# EAGLE design prog (EAGLE 9.2.2)
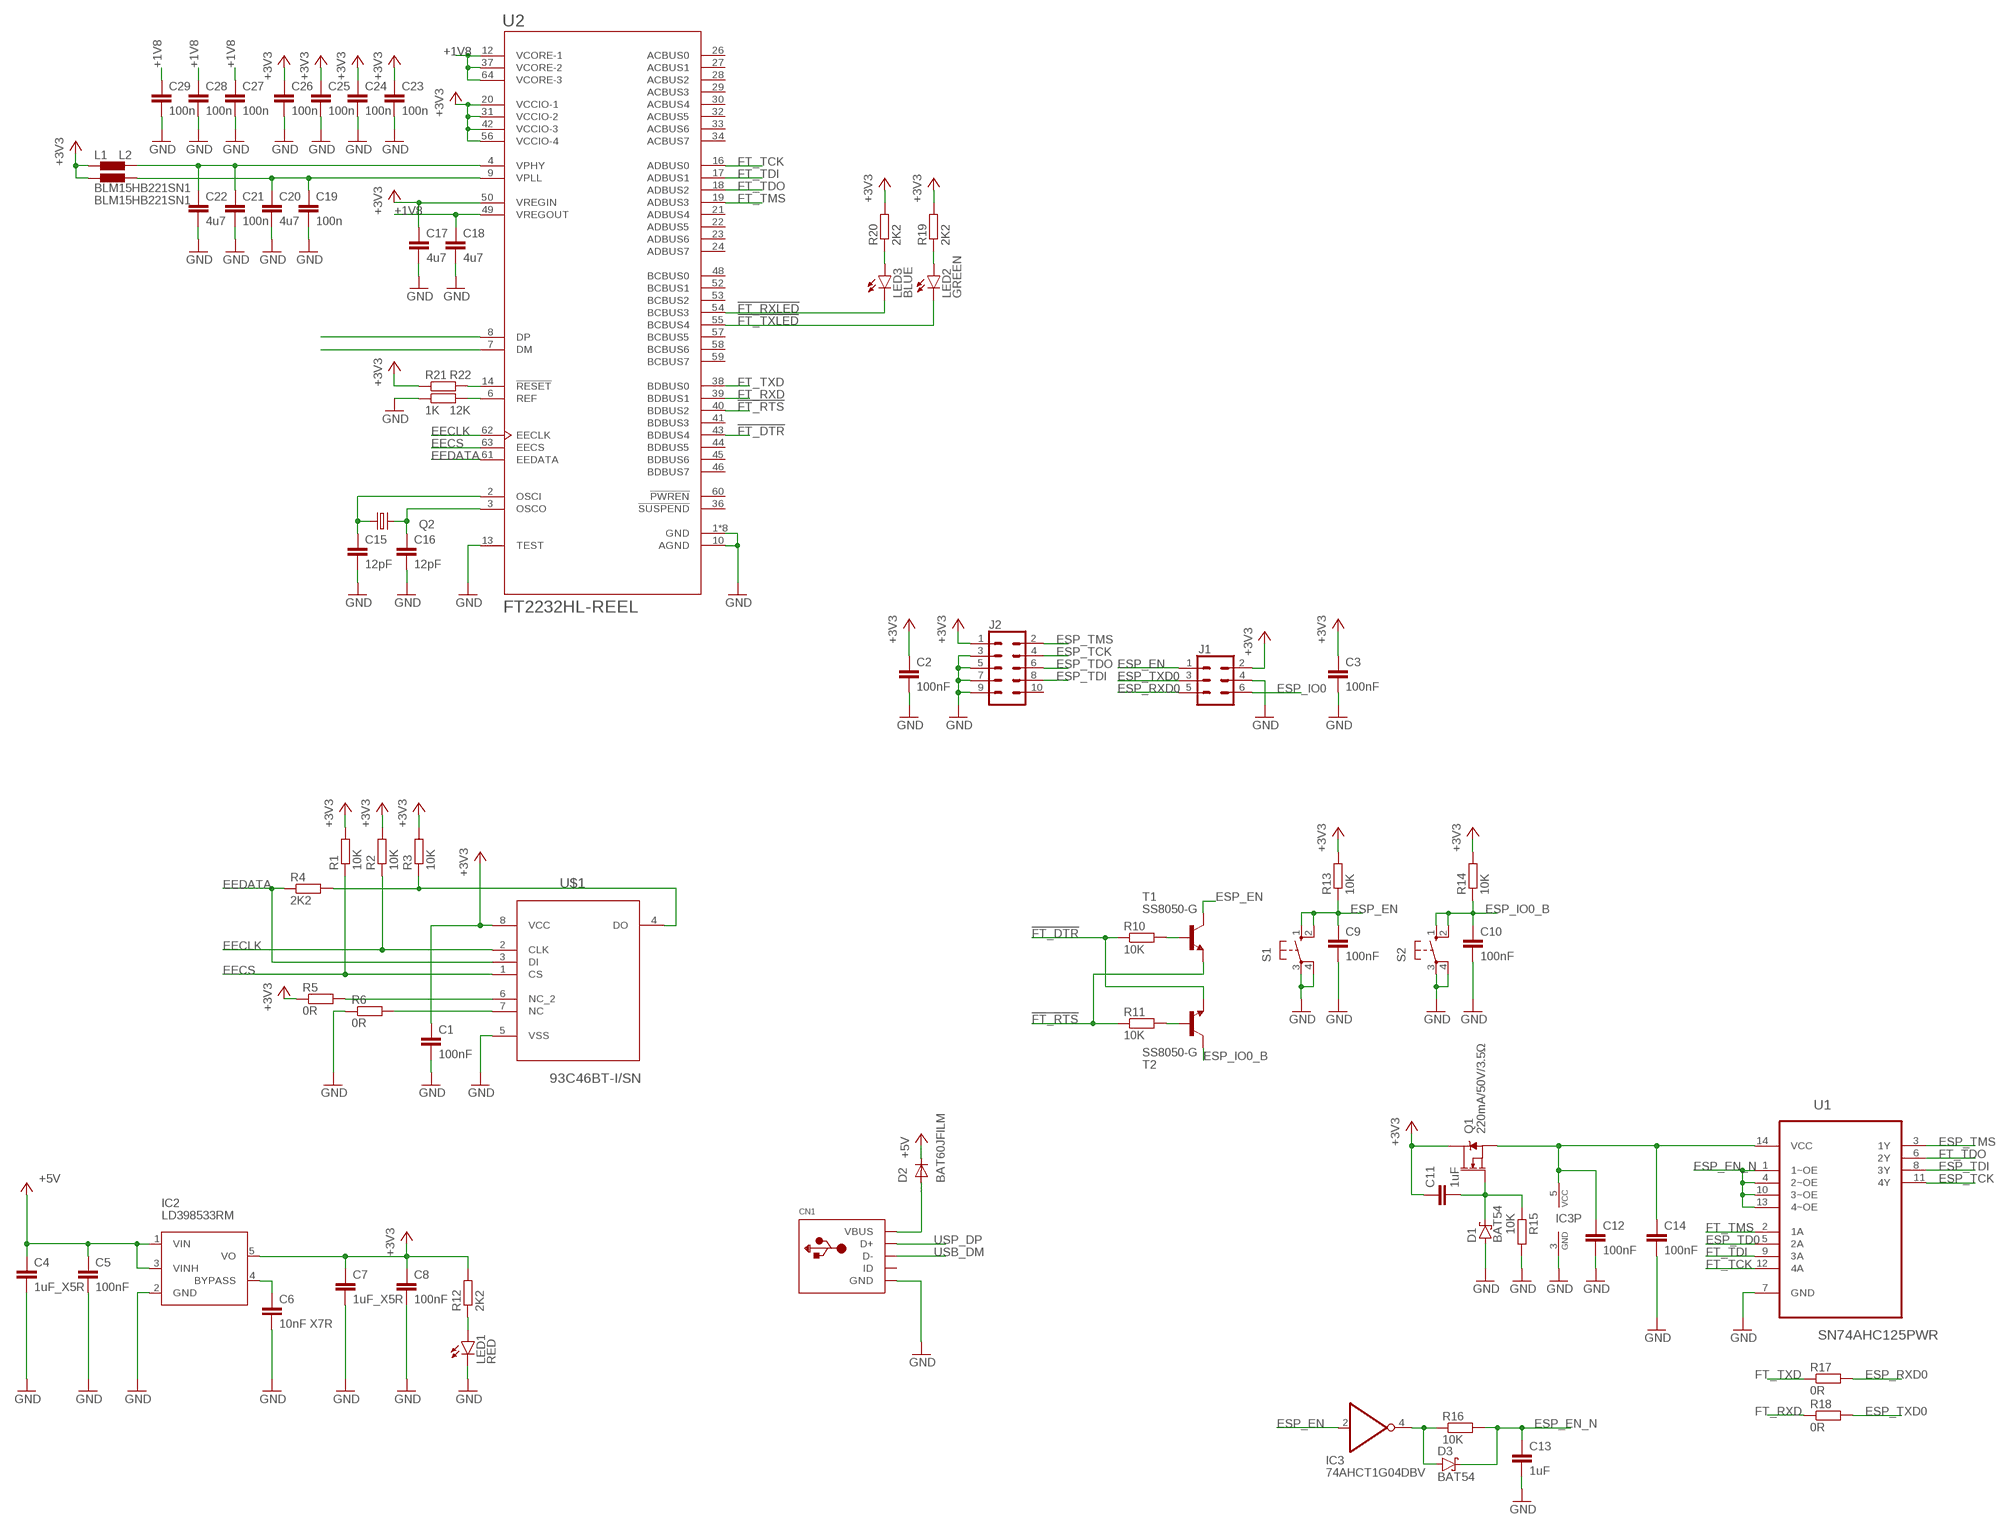
[diagram p0: schematic, sheet 1]

## Parts
C1  100nF  C-EUC0805  [C0805]
C2  100nF  C-EUC0805  [C0805]
C3  100nF  C-EUC0805  [C0805]
C4  1uF_X5R  C-EUC0805  [C0805]
C5  100nF  C-EUC0805  [C0805]
C6  10nF X7R  C-EUC0805  [C0805]
C7  1uF_X5R  C-EUC0805  [C0805]
C8  100nF  C-EUC0805  [C0805]
C9  100nF  C-EUC0805  [C0805]
C10  100nF  C-EUC0805  [C0805]
C11  1uF  C-EUC0805  [C0805]
C12  100nF  C-EUC0805  [C0805]
C13  1uF  C-EUC0805  [C0805]
C14  100nF  C-EUC0805  [C0805]
C15  12pF  C-EUC0805  [C0805]
C16  12pF  C-EUC0805  [C0805]
C17  4u7  C-EUC0805  [C0805]
C18  4u7  C-EUC0805  [C0805]
C19  100n  C-EUC0805  [C0805]
C20  4u7  C-EUC0805  [C0805]
C21  100n  C-EUC0805  [C0805]
C22  4u7  C-EUC0805  [C0805]
C23  100n  C-EUC0805  [C0805]
C24  100n  C-EUC0805  [C0805]
C25  100n  C-EUC0805  [C0805]
C26  100n  C-EUC0805  [C0805]
C27  100n  C-EUC0805  [C0805]
C28  100n  C-EUC0805  [C0805]
C29  100n  C-EUC0805  [C0805]
CN1  USBMINIB  [USB-MINIB]
D1  BAT54  [SOT23]
D2  BAT60JFILM  DIODE-SOD323-W  [SOD323-W]
D3  BAT54  [SOT23]
IC2  LD398533RM  [SOT23-5L]
IC3  74AHCT1G04DBV  [SOT23-5]
J1  CONN_03X2SHROUD  [2X3-SHROUDED]
J2  CONN_05X2SHD  [2X5-SHROUDED]
L1  BLM15HB221SN1  [0402]
L2  BLM15HB221SN1  [0402]
LED1  RED  LEDCHIP-LED0805  [CHIP-LED0805]
LED2  GREEN  LEDCHIPLED_0805  [CHIPLED_0805]
LED3  BLUE  LEDCHIPLED_0805  [CHIPLED_0805]
Q1  220mA/50V/3.5Ω  MOSFET-NCH-BSS138  [SOT23-3]
Q2  CRYSTALHC49UP  [HC49UP]
R1  10K  R-EU_R0805  [R0805]
R2  10K  R-EU_R0805  [R0805]
R3  10K  R-EU_R0805  [R0805]
R4  2K2  R-EU_R0805  [R0805]
R5  0R  R-EU_R0805  [R0805]
R6  0R  R-EU_R0805  [R0805]
R10  10K  R-EU_R0805  [R0805]
R11  10K  R-EU_R0805  [R0805]
R12  2K2  R-EU_R0805  [R0805]
R13  10K  R-EU_R0805  [R0805]
R14  10K  R-EU_R0805  [R0805]
R15  10K  R-EU_R0805  [R0805]
R16  10K  R-EU_R0805  [R0805]
R17  0R  R-EU_R0805  [R0805]
R18  0R  R-EU_R0805  [R0805]
R19  2K2  R-EU_R0805  [R0805]
R20  2K2  R-EU_R0805  [R0805]
R21  12K  R-EU_R0805  [R0805]
R22  1K  R-EU_R0805  [R0805]
S1  10-XX  [B3F-10XX]
S2  10-XX  [B3F-10XX]
T1  SS8050-G  BCF29-NPN-SOT23-BEC  [SOT23-BEC]
T2  SS8050-G  BCF29-NPN-SOT23-BEC  [SOT23-BEC]
U1  SN74AHC125PWR  [SOP65P640X120-14N]
U2  FT2232HL-REEL  [QFP50P1200X1200X160-64N]
U$1  93C46BT-I/SN  [SOIC127P600X175-8N]

## Nets
!FT_DTR: R10.1 T2.E U2.43(BDBUS4)
!FT_RTS: R11.1 T1.E U2.40(BDBUS2)
!FT_RXLED: LED3.C U2.54(BCBUS3)
!FT_TXLED: LED2.C U2.55(BCBUS4)
+1V8: C18.1 C27.1 C28.1 C29.1 U2.12(VCORE-1) U2.37(VCORE-2) U2.49(VREGOUT) U2.64(VCORE-3)
+3V3: C1.1 C2.1 C3.1 C7.1 C8.1 C11.1 C17.1 C23.1 C24.1 C25.1 C26.1 IC2.5(VO) J1.2 J2.1 L1.1 L2.1 Q1.3(D) R1.2 R2.2 R3.2 R5.1 R12.2 R13.2 R14.2 R19.2 R20.2 R22.1 U2.20(VCCIO-1) U2.31(VCCIO-2) U2.42(VCCIO-3) U2.50(VREGIN) U2.56(VCCIO-4) U$1.8(VCC)
+5V: C4.1 C5.1 D2.C IC2.1(VIN) IC2.3(VINH)
EECLK: R2.1 U2.62(EECLK) U$1.2(CLK)
EECS: R1.1 U2.63(EECS) U$1.1(CS)
EEDATA: R4.1 U2.61(EEDATA) U$1.3(DI)
ESP_EN: C9.1 IC3.2(I) J1.1 R13.1 S1.1(S) S1.2(S1) T1.C
ESP_EN_N: C13.1 D3.3(C) R16.2 U1.1(1~OE) U1.4(2~OE) U1.10(3~OE) U1.13(4~OE)
ESP_IO0: J1.6
ESP_IO0_B: C10.1 R14.1 S2.1(S) S2.2(S1) T2.C
ESP_RXD0: J1.5 R17.2
ESP_TCK: J2.4 U1.11(4Y)
ESP_TD0: U1.5(2A)
ESP_TDI: J2.8 U1.8(3Y)
ESP_TDO: J2.6
ESP_TMS: J2.2 U1.3(1Y)
ESP_TXD0: J1.3 R18.2
FT_RXD: R18.1 U2.39(BDBUS1)
FT_TCK: U1.12(4A) U2.16(ADBUS0)
FT_TDI: U1.9(3A) U2.17(ADBUS1)
FT_TDO: U1.6(2Y) U2.18(ADBUS2)
FT_TMS: U1.2(1A) U2.19(ADBUS3)
FT_TXD: R17.1 U2.38(BDBUS0)
GND: C1.2 C2.2 C3.2 C4.2 C5.2 C6.2 C7.2 C8.2 C9.2 C10.2 C12.2 C13.2 C14.2 C15.2 C16.2 C17.2 C18.2 C19.2 C20.2 C21.2 C22.2 C23.2 C24.2 C25.2 C26.2 C27.2 C28.2 C29.2 CN1.GND D1.1(A) IC2.2(GND) IC3.3(GND) J1.4 J2.3 J2.5 J2.7 J2.9 LED1.C R6.1 R15.2 R21.1 S1.3(P) S1.4(P1) S2.3(P) S2.4(P1) U1.7(GND) U2.1(GND) U2.5(GND) U2.10(AGND) U2.11(GND) U2.13(TEST) U2.15(GND) U2.25(GND) U2.35(GND) U2.47(GND) U2.51(GND) U$1.5(VSS)
N$1: R5.2 U$1.6(NC_2)
N$2: R6.2 U$1.7(NC)
N$4: R3.1 R4.2 U$1.4(DO)
N$7: LED1.A R12.1
N$8: C11.2 D1.3(C) Q1.1(G) R15.1
N$9: D3.1(A) IC3.4(O) R16.1
N$10: C12.1 C14.1 IC3.5(VCC) Q1.2(S) U1.14(VCC)
N$11: LED3.A R20.1
N$12: LED2.A R19.1
N$13: C15.1 Q2.1 U2.2(OSCI)
N$14: C16.1 Q2.2 U2.3(OSCO)
N$15: R22.2 U2.14(!RESET)
N$16: R21.2 U2.6(REF)
N$17: U2.8(DP)
N$18: U2.7(DM)
N$19: C19.1 C20.1 L2.2 U2.9(VPLL)
N$20: C21.1 C22.1 L1.2 U2.4(VPHY)
N$42: R10.2 T1.B
N$43: R11.2 T2.B
N$102: C6.1 IC2.4(BYPASS)
USB_DM: CN1.D-
USP_DP: CN1.D+
VBUS1: CN1.VBUS D2.A
Unconnected: CN1.ID J2.10 U2.21(ADBUS4) U2.22(ADBUS5) U2.23(ADBUS6) U2.24(ADBUS7) U2.26(ACBUS0) U2.27(ACBUS1) U2.28(ACBUS2) U2.29(ACBUS3) U2.30(ACBUS4) U2.32(ACBUS5) U2.33(ACBUS6) U2.34(ACBUS7) U2.36(!SUSPEND) U2.41(BDBUS3) U2.44(BDBUS5) U2.45(BDBUS6) U2.46(BDBUS7) U2.48(BCBUS0) U2.52(BCBUS1) U2.53(BCBUS2) U2.57(BCBUS5) U2.58(BCBUS6) U2.59(BCBUS7) U2.60(!PWREN)

## Library data of the parts
C1-C29 = resistor:C-EU: CAPACITOR, European symbol
CN1 = adafruit:USB: USB Connectors USBMINIB - Surface Mount Female Mini-B USB Connector 4UConnector: 06564 By microbuilder.eu Thru-hole RA Female Mini-B USB Connector 4UConnector: 18732 By ladyada.net
D1 D3 = diode:BAT54: Schottky Diodes Source: Fairchild .. BAT54.pdf
D2 = diode:DIODE-: DIODE
IC2 = st-microelectronics:LD3985: Ultra low drop and low noise BiCMOS voltage regulators Source: www.st.com LD3985.pdf
IC3 = 74xx-little-de:74*1G04: INVERTER Gate
J1 = SparkFun-Connectors:CONN_03X2: Multi connection point. Often used as Generic Header-pin footprint for 0.1 inch spaced/style header connections You can populate with any combo of single row headers, but if you'd like an exact match, check these: Header - 2x3 (Male, 0.1") <https://www.sparkfun.com/products/12807> (PRT-12807) Header - 2x3 (Female, 0.1") <https://www.sparkfun.com/products/13010> (PRT-13010) 2x3 Pin Shrouded Header <https://www.sparkfun.com/products/10877> (PRT-10877) On any of the 0.1 inch spaced packages, you can populate with these: Break Away Headers - Straight <https://www.sparkfun.com/products/116> (PRT-00116) Break Away Male Headers - Right Angle <https://www.sparkfun.com/products/553> (PRT-00553) Female Headers <https://www.sparkfun.com/products/115> (PRT-00115) Break Away Headers - Machine Pin <https://www.sparkfun.com/products/117> (PRT-00117) Break Away Female Headers - Swiss Machine Pin <https://www.sparkfun.com/products/743> (PRT-00743) Special note: the shrouded connector mates well with our 3x2 ribbon cables: Ribbon Crimp Connector - 6-pin (2x3, Female) <https://www.sparkfun.com/products/10651> (PRT-10651) Ribbon Cable - 6 wire (15ft) <https://www.sparkfun.com/products/10646> (PRT-10646); PROD_ID: CONN-10681; SF_ID: PRT_10877
J2 = SparkFun-Connectors:CONN_05X2: Multi connection point. Often used as Generic Header-pin footprint for 0.1 inch spaced/style header connections For AVR SPI programming port, see special device with nice symbol: "AVR_SPI_PROG_5x2.dev" You can populate with any combo of single row headers, but if you'd like an exact match, check these: 2x5 AVR ICSP Male Header <https://www.sparkfun.com/products/778> (PRT-00778) 2x5 Pin Shrouded Header <https://www.sparkfun.com/products/8506> (PRT-08506) On any of the 0.1 inch spaced packages, you can populate with these: Break Away Headers - Straight <https://www.sparkfun.com/products/116> (PRT-00116) Break Away Male Headers - Right Angle <https://www.sparkfun.com/products/553> (PRT-00553) Female Headers <https://www.sparkfun.com/products/115> (PRT-00115) Break Away Headers - Machine Pin <https://www.sparkfun.com/products/117> (PRT-00117) Break Away Female Headers - Swiss Machine Pin <https://www.sparkfun.com/products/743> (PRT-00743) Special note: the shrouded connector mates well with our 5x2 ribbon cables: 2x5 Pin IDC Ribbon Cable <https://www.sparkfun.com/products/8535> (PRT-08535); PROD_ID: CONN-08671; SF_ID: PRT-08506
L1 L2 = inductors:BLM15H: EMIFIL (R) Chip Ferrite Bead for GHz Noise Source: http://www.murata.com/ Ferrite Bead BLM15H.pdf
LED1-LED3 = led:LED: LED OSRAM: - CHIPLED LG R971, LG N971, LY N971, LG Q971, LY Q971, LO R971, LY R971 LH N974, LH R974 LS Q976, LO Q976, LY Q976 LO Q996 - Hyper CHIPLED LW Q18S LB Q993, LB Q99A, LB R99A - SideLED LS A670, LO A670, LY A670, LG A670, LP A670 LB A673, LV A673, LT A673, LW A673 LH A674 LY A675 LS A676, LA A676, LO A676, LY A676, LW A676 LS A679, LY A679, LG A679 - Hyper Micro SIDELED® LS Y876, LA Y876, LO Y876, LY Y876 LT Y87S - SmartLED LW L88C, LW L88S LB L89C, LB L89S, LG L890 LS L89K, LO L89K, LY L89K LS L896, LA L896, LO L896, LY L896 - TOPLED LS T670, LO T670, LY T670, LG T670, LP T670 LSG T670, LSP T670, LSY T670, LOP T670, LYG T670 LG T671, LOG T671, LSG T671 LB T673, LV T673, LT T673, LW T673 LH T674 LS T676, LA T676, LO T676, LY T676, LB T676, LH T676, LSB T676, LW T676 LB T67C, LV T67C, LT T67C, LS T67K, LO T67K, LY T67K, LW E67C LS E67B, LA E67B, LO E67B, LY E67B, LB E67C, LV E67C, LT E67C LW T67C LS T679, LY T679, LG T679 LS T770, LO T770, LY T770, LG T770, LP T770 LB T773, LV T773, LT T773, LW T773 LH T774 LS E675, LA E675, LY E675, LS T675 LS T776, LA T776, LO T776, LY T776, LB T776 LHGB T686 LT T68C, LB T68C - Hyper Mini TOPLED® LB M676 - Mini TOPLED Santana® LG M470 LS M47K, LO M47K, LY M47K Source: http://www.osram.convergy.de LUXEON: - LUMILED® LXK2-PW12-R00, LXK2-PW12-S00, LXK2-PW14-U00, LXK2-PW14-V00 LXK2-PM12-R00, LXK2-PM12-S00, LXK2-PM14-U00 LXK2-PE12-Q00, LXK2-PE12-R00, LXK2-PE12-S00, LXK2-PE14-T00, LXK2-PE14-U00 LXK2-PB12-K00, LXK2-PB12-L00, LXK2-PB12-M00, LXK2-PB14-N00, LXK2-PB14-P00, LXK2-PB14-Q00 LXK2-PR12-L00, LXK2-PR12-M00, LXK2-PR14-Q00, LXK2-PR14-R00 LXK2-PD12-Q00, LXK2-PD12-R00, LXK2-PD12-S00 LXK2-PH12-R00, LXK2-PH12-S00 LXK2-PL12-P00, LXK2-PL12-Q00, LXK2-PL12-R00 Source: www.luxeon.com KINGBRIGHT: KA-3528ASYC Source: www.kingbright.com
Q1 = SparkFun-DiscreteSemi:MOSFET-NCH: N-channel MOSFETs Voltage controlled devices that allow control of high current outputs. SparkFun Products: SparkFun OpenScale <https://www.sparkfun.com/products/13261> SparkFun Digital Sandbox <https://www.sparkfun.com/products/12651> SparkFun Monster Moto Shield <https://www.sparkfun.com/products/10182> SparkFun MOSFET Power Controller <https://www.sparkfun.com/products/11214>; PROD_ID: TRANS-00830
Q2 = crystal:CRYSTAL: CRYSTAL; OC_FARNELL: unknown; OC_NEWARK: unknown
R1-R6 R10-R22 = resistor:R-EU_: RESISTOR, European symbol
S1 S2 = switch-omron:10-XX: OMRON SWITCH; MPN: B3F-1000; OC_FARNELL: 176432; OC_NEWARK: 36M3542
T1 T2 = transistor:*-NPN-: NPN Transistror BF959 corrected 2008.03.06
U1 = SN74AHC125PWR:SN74AHC125PWR: QUADRUPLE BUS BUFFER GATES WITH 3-STATE OUTPUTS; AVAILABILITY: Unavailable; DESCRIPTION: Quadruple Bus Buffer Gates With 3-State Outputs 14-TSSOP -40 to 125; MF: Texas Instruments; MP: SN74AHC125PWR; PACKAGE: TSSOP-14 Texas Instruments; PRICE: None
U2 = FT2232HL-REEL:FT2232HL-REEL: USB Hi-Speed to Dual Channel Serial UART/FIFO/JTAG/SPI/I2C IC - LQFP-64; AVAILABILITY: Unavailable; DESCRIPTION: USB Hi-Speed to Dual Channel Serial UART/FIFO/JTAG/SPI/I2C IC - LQFP-64; MF: FTDI,; MP: FT2232HL-REEL; PACKAGE: LQFP-64 FTDI; PRICE: None
U$1 = 93C46BT-I_SN:93C46BT-I/SN: 1K Microwire Compatible Serial EEPROM; AVAILABILITY: Unavailable; DESCRIPTION: 93C46 Series 1 Kbit _64 x 16_ 5.5 V Microwire Compatible Serial EEPROM - SOIC-8; MF: Microchip; MP: 93C46BT-I/SN; PACKAGE: SOIC-8 Microchip; PRICE: None

## Net classes
2 gnd: width 0.305 mm, drill 0.559 mm, clearance 0.152 mm

## Board
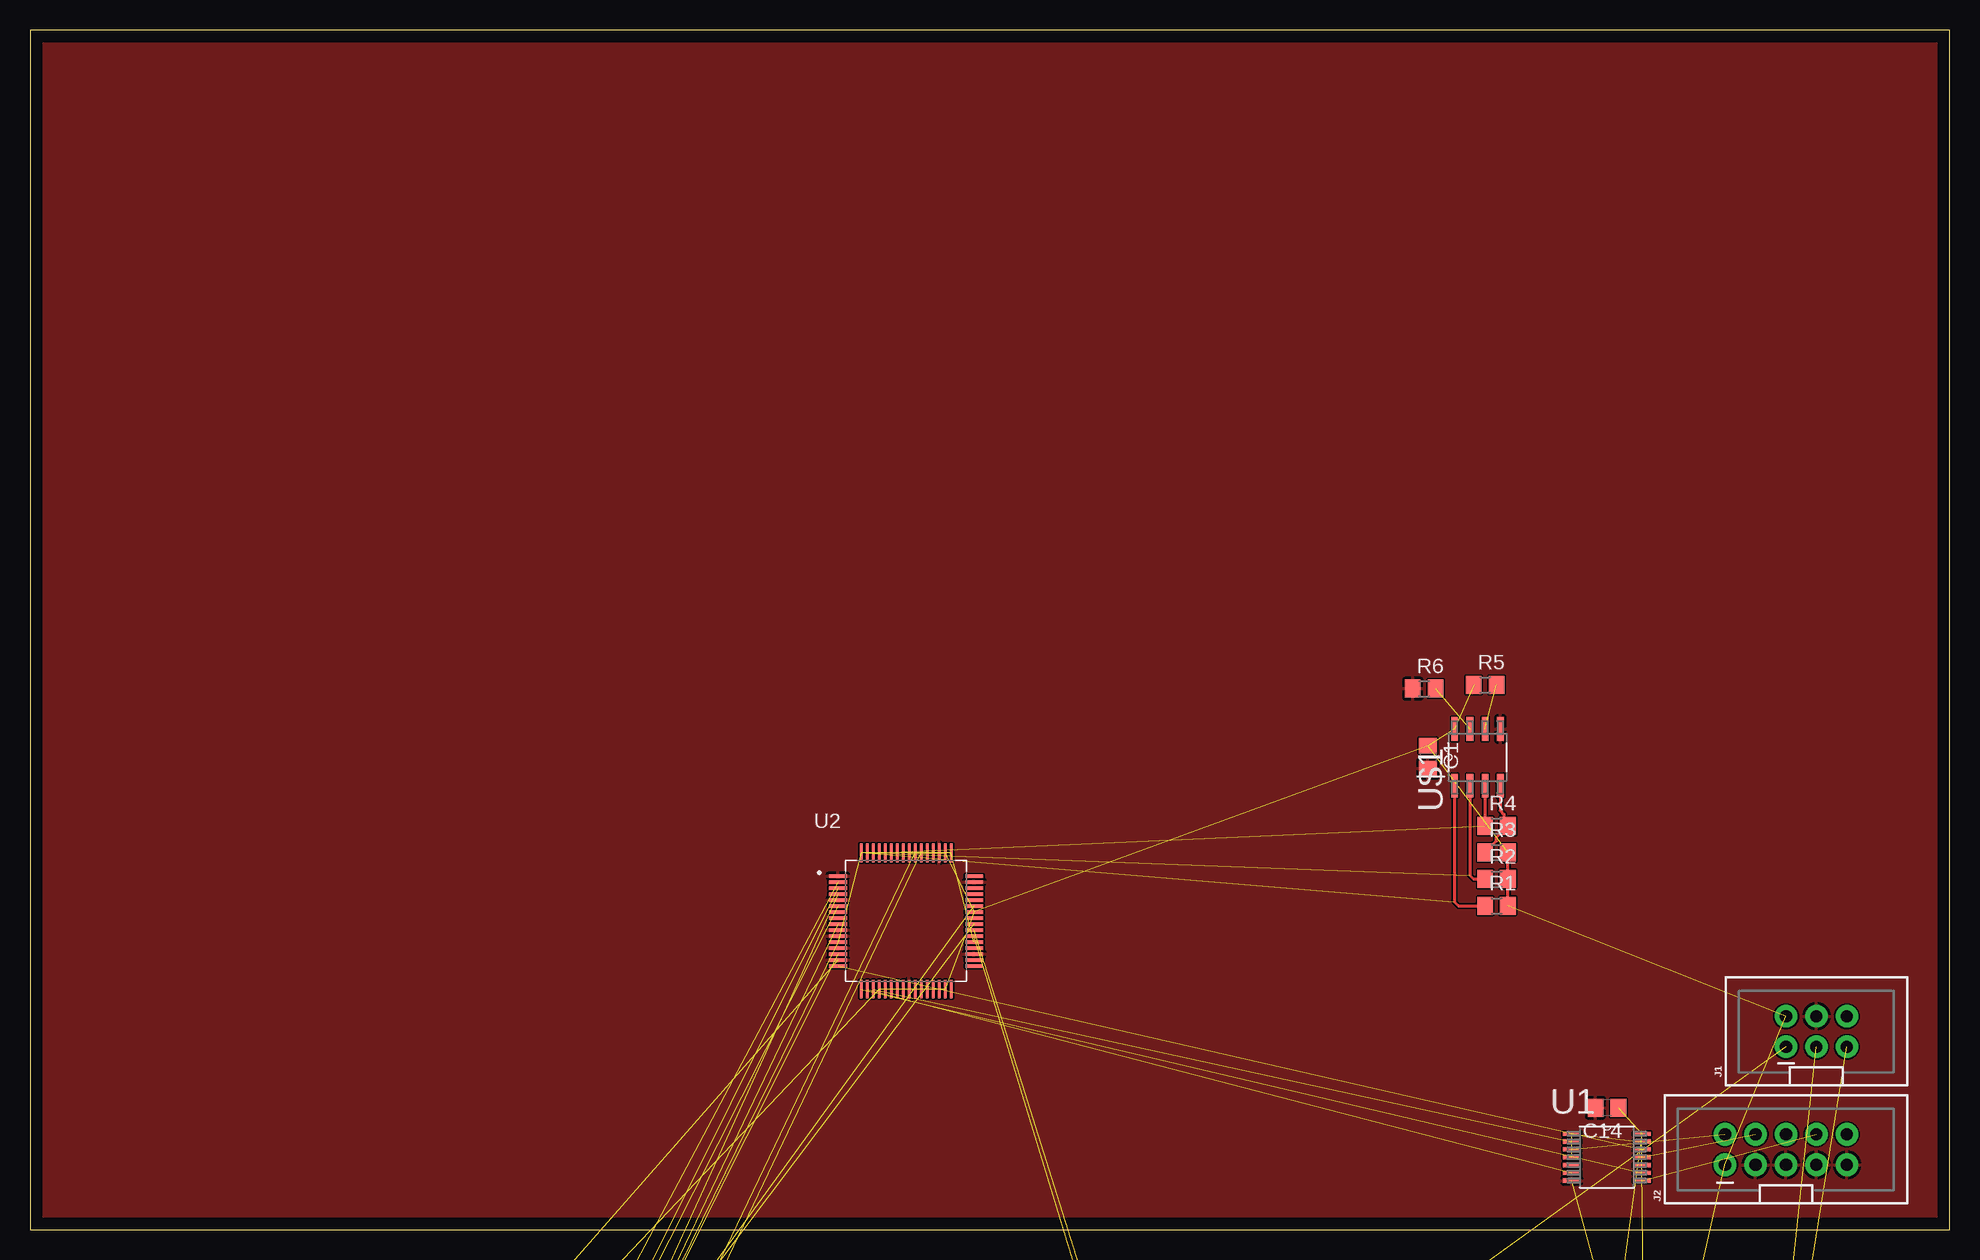
[diagram p1: board, top side]
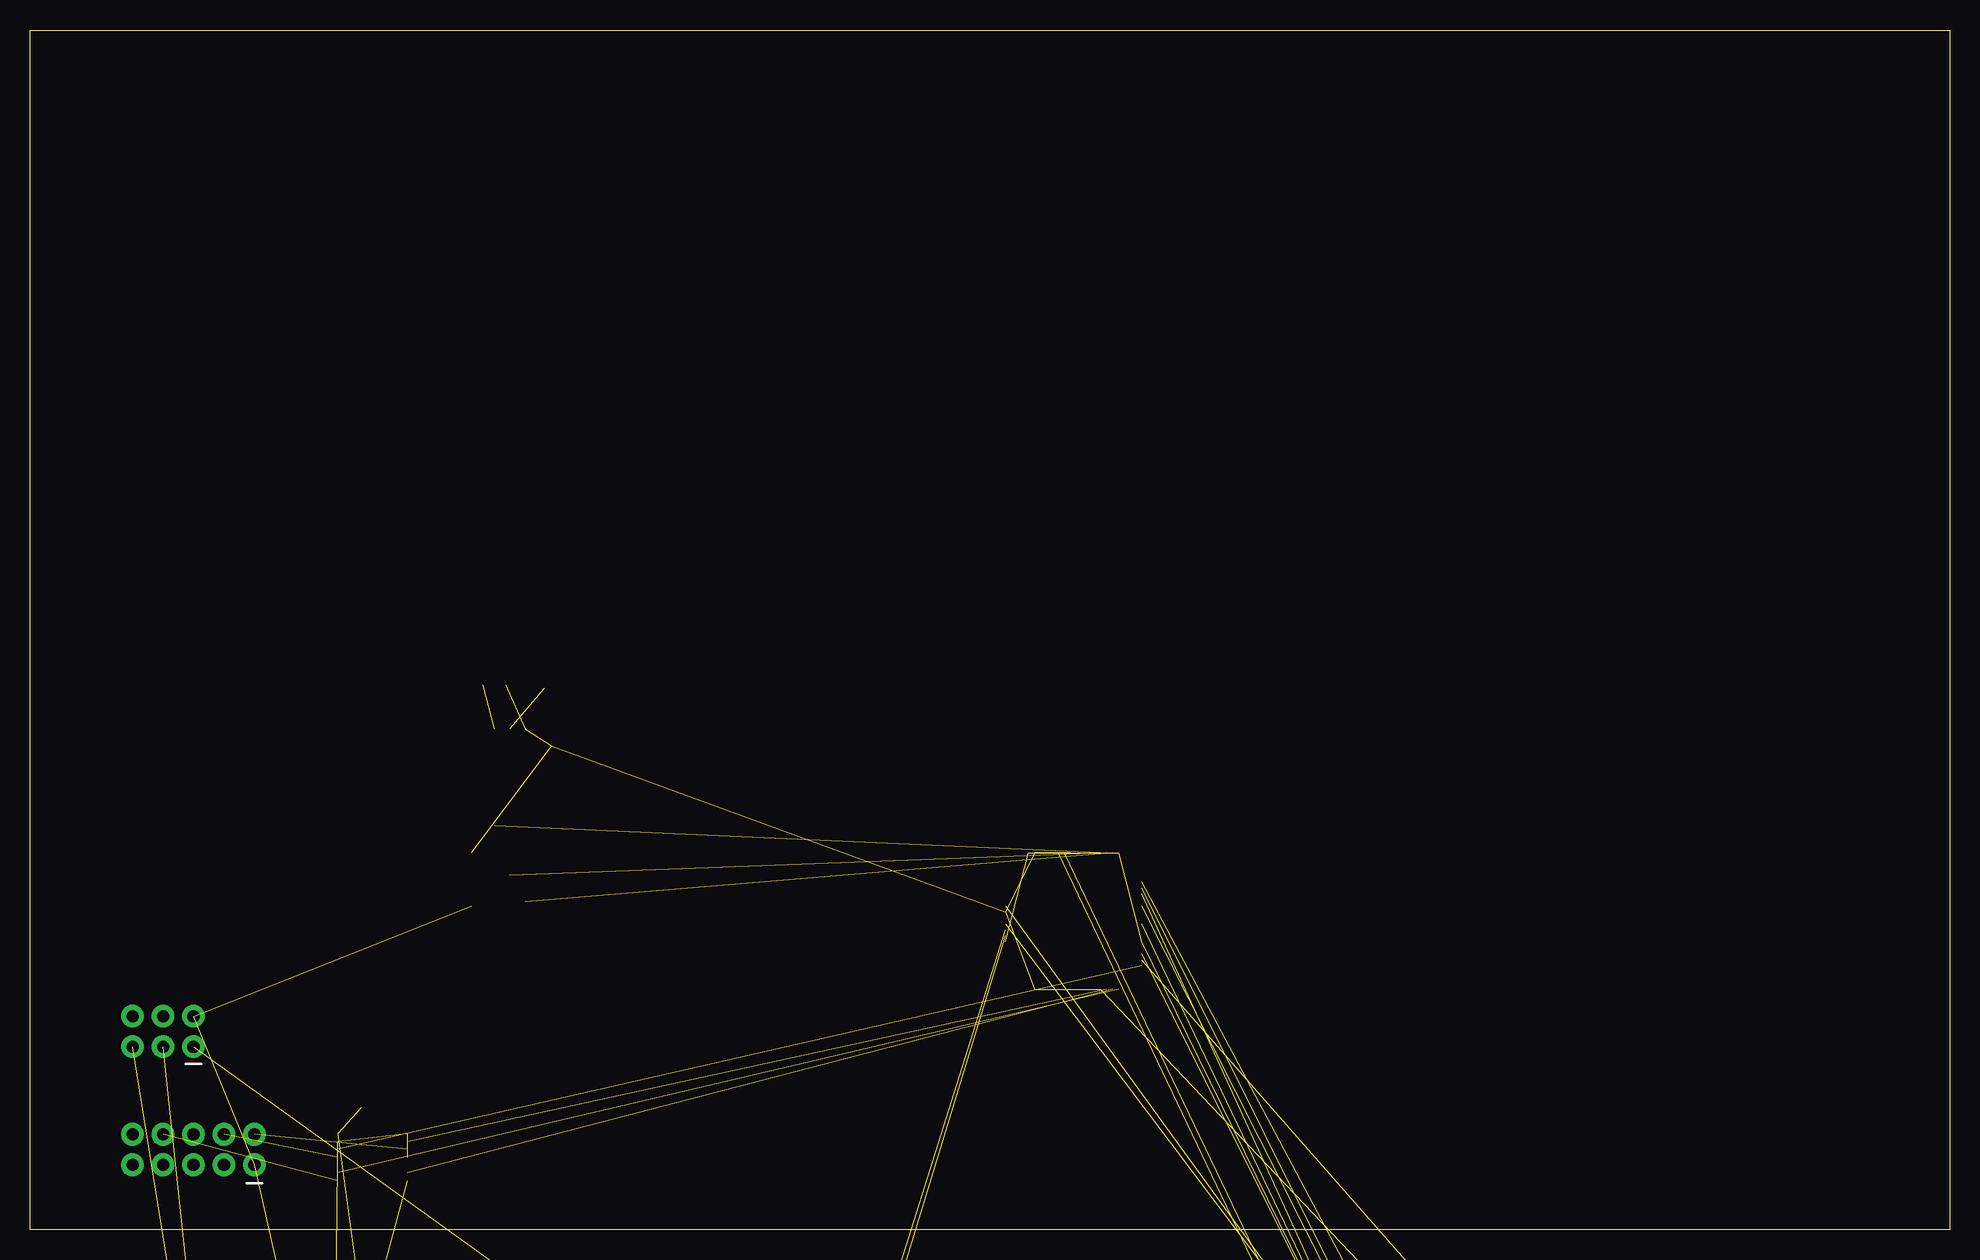
[diagram p2: board, bottom side, seen from below]

Size 160 x 100 mm. Coordinates in mm from the lower left corner, seen from the top.
Outline: 0,0 160,0 160,100 0,100 0,0
Copper layers (1*16): Top 0.035mm / dielectric 1.5mm / Bottom 0.035mm
Design rules "default": minimum track width 6mil, minimum drill 0.35mm, track to track 6mil, track to pad 6mil, pad to pad 6mil, via to via 6mil, smd to smd 6mil, copper to edge 40mil, drill to drill 6mil, minimum pad ring 10mil, minimum via ring 8mil, stop-mask expansion 4mil, vias tented up to drill 0mil, thermal gap 10mil

### Footprints (pad centres in the part's own frame; a part is rotated, then mirrored left to right if it is on the bottom)
C0805 = smd 1.3 x 1.5: 1 -0.95,0; 2 0.95,0
USB-MINIB = smd 0.5 x 2.308: D+ 0,4.064; D- -0.8,4.064; GND 1.6,4.064; ID 0.8,4.064; VBUS -1.6,4.064 | smd 2 x 2.4: GND1 -4.4,-2; GND2 -4.4,3.5; GND3 4.4,3.5; GND4 4.4,-2 | hole 1: -2.2,1; 2.2,1
SOT23 = smd 1 x 1.4: 1 -0.95,-1.1; 2 0.95,-1.1; 3 0,1.1
SOD323-W = smd 1.5 x 1.2: A 1.45,0; C -1.45,0
SOT23-5L = smd 0.6 x 1.2: 1 -0.95,-1.15; 2 0,-1.15; 3 0.95,-1.15; 4 0.95,1.15; 5 -0.95,1.15
SOT23-5 = smd 0.69 x 0.99: 1 -0.95,-1.29; 2 0,-1.29; 3 0.95,-1.29; 4 0.95,1.3; 5 -0.95,1.3
2X3-SHROUDED = drill 1.016 pad 1.88: 1 -1.27,2.54; 2 1.27,2.54; 3 -1.27,0; 4 1.27,0; 5 -1.27,-2.54; 6 1.27,-2.54
2X5-SHROUDED = drill 1.016 pad 1.88: 1 -1.27,5.08; 2 1.27,5.08; 3 -1.27,2.54; 4 1.27,2.54; 5 -1.27,0; 6 1.27,0; 7 -1.27,-2.54; 8 1.27,-2.54; 9 -1.27,-5.08; 10 1.27,-5.08
0402 = smd 0.7 x 0.9: 1 -0.65,0; 2 0.65,0
CHIP-LED0805 = smd 1.2 x 1.2: A 0,-1.05; C 0,1.05
CHIPLED_0805 = smd 1.2 x 1.2: A 0,-1.05; C 0,1.05
SOT23-3 = smd 0.8 x 0.9: 1 -0.95,-1; 2 0.95,-1; 3 0,1.1
HC49UP = smd 5.334 x 1.93: 1 -4.826,0; 2 4.826,0
R0805 = smd 1.3 x 1.5: 1 -0.95,0; 2 0.95,0
B3F-10XX = drill 1.016 long: 1 -3.251,2.261; 2 3.251,2.261; 3 -3.251,-2.261; 4 3.251,-2.261
SOT23-BEC = smd 1 x 1.4: B -0.95,-1.1; C 0,1.1; E 0.95,-1.1
SOP65P640X120-14N = smd 1.473 x 0.356: 1 -2.921,1.956; 2 -2.921,1.295; 3 -2.921,0.66; 4 -2.921,0; 5 -2.921,-0.66; 6 -2.921,-1.295; 7 -2.921,-1.956; 8 2.921,-1.956; 9 2.921,-1.295; 10 2.921,-0.66; 11 2.921,0; 12 2.921,0.66; 13 2.921,1.295; 14 2.921,1.956
QFP50P1200X1200X160-64N = smd 1.56 x 0.28: 1 -5.68,3.75; 2 -5.68,3.25; 3 -5.68,2.75; 4 -5.68,2.25; 5 -5.68,1.75; 6 -5.68,1.25; 7 -5.68,0.75; 8 -5.68,0.25; 9 -5.68,-0.25; 10 -5.68,-0.75; 11 -5.68,-1.25; 12 -5.68,-1.75; 13 -5.68,-2.25; 14 -5.68,-2.75; 15 -5.68,-3.25; 16 -5.68,-3.75; 33 5.68,-3.75; 34 5.68,-3.25; 35 5.68,-2.75; 36 5.68,-2.25; 37 5.68,-1.75; 38 5.68,-1.25; 39 5.68,-0.75; 40 5.68,-0.25; 41 5.68,0.25; 42 5.68,0.75; 43 5.68,1.25; 44 5.68,1.75; 45 5.68,2.25; 46 5.68,2.75; 47 5.68,3.25; 48 5.68,3.75 | smd 0.28 x 1.56: 17 -3.75,-5.68; 18 -3.25,-5.68; 19 -2.75,-5.68; 20 -2.25,-5.68; 21 -1.75,-5.68; 22 -1.25,-5.68; 23 -0.75,-5.68; 24 -0.25,-5.68; 25 0.25,-5.68; 26 0.75,-5.68; 27 1.25,-5.68; 28 1.75,-5.68; 29 2.25,-5.68; 30 2.75,-5.68; 31 3.25,-5.68; 32 3.75,-5.68; 49 3.75,5.68; 50 3.25,5.68; 51 2.75,5.68; 52 2.25,5.68; 53 1.75,5.68; 54 1.25,5.68; 55 0.75,5.68; 56 0.25,5.68; 57 -0.25,5.68; 58 -0.75,5.68; 59 -1.25,5.68; 60 -1.75,5.68; 61 -2.25,5.68; 62 -2.75,5.68; 63 -3.25,5.68; 64 -3.75,5.68
SOIC127P600X175-8N = smd 1.981 x 0.559: 1 -2.362,1.905; 2 -2.362,0.635; 3 -2.362,-0.635; 4 -2.362,-1.905; 5 2.362,-1.905; 6 2.362,-0.635; 7 2.362,0.635; 8 2.362,1.905

### Placement (x,y rotation side)
C1  116.52,39.37 270 top
C2  -29.21,-86.36 0 top  (outside the outline)
C3  -29.21,-92.71 0 top  (outside the outline)
C4  -5.08,-149.86 270 top  (outside the outline)
C5  -7.62,-149.86 270 top  (outside the outline)
C6  -11.43,-146.05 0 top  (outside the outline)
C7  -15.24,-149.86 90 top  (outside the outline)
C8  -17.78,-149.86 90 top  (outside the outline)
C9  -49.53,-172.72 0 top  (outside the outline)
C10  -49.53,-179.07 0 top  (outside the outline)
C11  133.99,-26.04 90 top  (outside the outline)
C12  -60.33,-177.8 270 top  (outside the outline)
C13  134.62,-17.46 270 top  (outside the outline)
C14  131.44,10.16 180 top
C15  -86.36,-264.8 0 top  (outside the outline)
C16  -86.36,-268.92 0 top  (outside the outline)
C17  -86.36,-287.97 0 top  (outside the outline)
C18  -86.36,-292.1 0 top  (outside the outline)
C19  -86.36,-298.45 0 top  (outside the outline)
C20  -86.36,-304.8 0 top  (outside the outline)
C21  -86.36,-311.15 0 top  (outside the outline)
C22  -86.36,-317.5 0 top  (outside the outline)
C23  -86.36,-334.01 0 top  (outside the outline)
C24  -86.36,-340.36 0 top  (outside the outline)
C25  -86.36,-346.71 0 top  (outside the outline)
C26  -86.36,-353.06 0 top  (outside the outline)
C27  -86.36,-359.41 0 top  (outside the outline)
C28  -86.36,-365.76 0 top  (outside the outline)
C29  -86.36,-372.11 0 top  (outside the outline)
CN1  -10.16,-126.68 270 top  (outside the outline)
D1  139.7,-26.04 0 top  (outside the outline)
D2  -1.59,-122.24 180 top  (outside the outline)
D3  140.02,-17.46 0 top  (outside the outline)
IC2  -11.43,-149.86 90 top  (outside the outline)
IC3  -56.83,-177.8 0 top  (outside the outline)
J1  148.91,16.51 90 top
J2  146.37,6.67 90 top
L1  -87,-323.21 0 top  (outside the outline)
L2  -87,-328.3 0 top  (outside the outline)
LED1  -22.86,-149.86 180 top  (outside the outline)
LED2  -60.64,-247.65 270 top  (outside the outline)
LED3  -60.64,-249.87 270 top  (outside the outline)
Q1  130.81,-26.04 180 top  (outside the outline)
Q2  -80.64,-258.44 0 top  (outside the outline)
R1  122.24,26.99 0 top
R2  122.24,29.21 0 top
R3  122.24,31.43 0 top
R4  122.24,33.66 0 top
R5  121.28,45.4 0 top
R6  116.2,45.09 0 top
R10  -21.91,-101.92 0 top  (outside the outline)
R11  -21.91,-104.14 180 top  (outside the outline)
R12  -20.32,-149.86 270 top  (outside the outline)
R13  -49.53,-160.02 0 top  (outside the outline)
R14  -49.53,-166.37 0 top  (outside the outline)
R15  136.53,-26.04 270 top  (outside the outline)
R16  136.84,-17.46 90 top  (outside the outline)
R17  127,-130.81 0 top  (outside the outline)
R18  131.44,-140.02 0 top  (outside the outline)
R19  -64.77,-247.65 180 top  (outside the outline)
R20  -64.77,-249.87 180 top  (outside the outline)
R21  -86.36,-275.27 0 top  (outside the outline)
R22  -86.36,-281.62 0 top  (outside the outline)
S1  -36.51,-150.81 0 top  (outside the outline)
S2  -46.67,-150.81 0 top  (outside the outline)
T1  -16.51,-101.28 270 top  (outside the outline)
T2  -16.51,-104.78 270 top  (outside the outline)
U1  131.44,6.03 0 top
U2  73.03,25.72 0 top
U$1  120.65,39.37 90 top

### Tracks (layer width: path | path; a pad name or v marks a point on that pad's centre or on a via)
!FT_DTR  (2 unrouted)
!FT_RTS  (2 unrouted)
!FT_RXLED  (1 unrouted)
!FT_TXLED  (1 unrouted)
+1V8  (7 unrouted)
+3V3  (30 unrouted)
  Top 0.254: R1.2 R2.2 R3.2
+5V  (4 unrouted)
EECLK  (1 unrouted)
  Top 0.254: U$1.2 120.02,29.53 120.33,29.21 R2.1
EECS  (1 unrouted)
  Top 0.254: U$1.1 118.75,27.3 119.06,26.99 R1.1
EEDATA  (1 unrouted)
  Top 0.254: U$1.3 R4.1
ESP_EN  (6 unrouted)
ESP_EN_N  (6 unrouted)
ESP_IO0_B  (4 unrouted)
ESP_RXD0  (1 unrouted)
ESP_TCK  (1 unrouted)
ESP_TDI  (1 unrouted)
ESP_TMS  (1 unrouted)
ESP_TXD0  (1 unrouted)
FT_RXD  (1 unrouted)
FT_TCK  (1 unrouted)
FT_TDI  (1 unrouted)
FT_TDO  (1 unrouted)
FT_TMS  (1 unrouted)
FT_TXD  (1 unrouted)
GND  (37 unrouted)
  pour Top: 0.32,100.01 162.88,100.01 162.88,-2.54 0.32,-2.54
N$1  (1 unrouted)
N$2  (1 unrouted)
N$4
  Top 0.254: R3.1 122.24,32.38 122.24,32.7 R4.2 | R4.2 | R4.2 122.87,33.97 122.87,34.61 122.56,34.92 U$1.4
N$7  (1 unrouted)
N$8  (3 unrouted)
N$9  (2 unrouted)
N$10  (4 unrouted)
N$11  (1 unrouted)
N$12  (1 unrouted)
N$13  (2 unrouted)
N$14  (2 unrouted)
N$15  (1 unrouted)
N$16  (1 unrouted)
N$19  (3 unrouted)
N$20  (3 unrouted)
N$42  (1 unrouted)
N$43  (1 unrouted)
N$102  (1 unrouted)
VBUS1  (1 unrouted)